# Altium project PhotodiodeDaughterBoard.PrjPcb
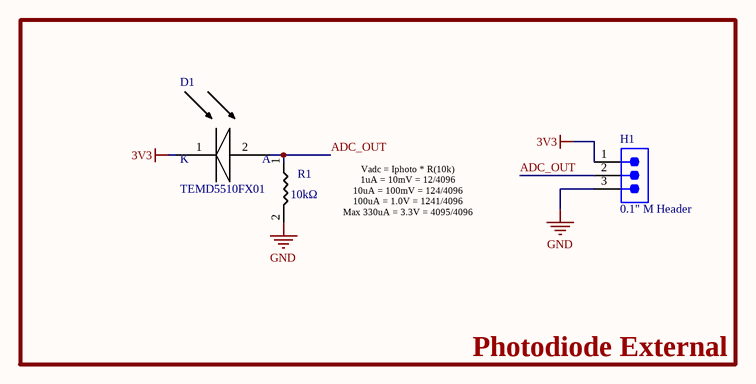
[diagram p0: PhotodiodeDaughterBoard.SchDoc]
1 sheet, 3 parts. Net scope: global (net labels, ports and power ports of the same name join across sheets).
Board file: PhotodiodeDaughterBoard.PcbDoc

## Sheet PhotodiodeDaughterBoard.SchDoc
size Letter; SheetNumber: 1; SheetTotal: 1

### Parts
D1  TEMD5510FX01  [TEMD5510FX01]
H1  0.1" M Header  [3_PIN_100mil_Photodiode]
R1  value 10kΩ  [0603_Resistor]  (hidden comment: 10kkΩ)

### Blocks framed on the sheet
Photodiode External: D1 H1 R1

### Nets
3V3: D1.1(K) H1.1
GND: H1.3 R1.2
ADC_OUT: D1.2(A) H1.2 R1.1

### Notes on the sheet
- (near R1) Vadc = Iphoto * R(10k)
  1uA = 10mV = 12/4096
  10uA = 100mV = 124/4096
  100uA = 1.0V = 1241/4096
  Max 330uA = 3.3V = 4095/4096

### Library data of the parts
D1 = TEMD5510FX01: Ambient Light Sensor Photodiode; Supplier: DigiKey; Digikey Part Number: TEMD5510FX01CT-ND
H1 = Photodiode_3Pin_100mil: CONN HEADER VERT 3POS 2.54MM; Manufacturer: Sullins; Manufacturer Part Number: PRPC003SAAN-RC; Connector Type: Header, Unshrouded, Breakaway; Number of Positions: 3; Number of Positions Loaded: All; Pitch: 0.100" (2.54mm); Online Catalog: 0.100" (2.54mm) Pitch Connector Headers; Other Names: S9510E-03  S9510E-03-ND; Supplier 1: Digi-Key; Stock 1: 19067; Pricing 1: 1=0.12, 10=0.109, 25=0.0812, 50=0.0696, 100=0.0673, 250=0.058, 500=0.0557 (USD); Standard Package: 1; Category: Connectors, Interconnects; Family: Rectangular Connectors - Headers, Male Pins; Series: -; Packaging: Bulk; Contact Type: Male Pin; Number of Rows: 1; Row Spacing: -; Contact Mating Length: 0.230" (5.84mm); Mounting Type: Through Hole; Termination: Solder; Fastening Type: -; Features: -; Contact Finish: Gold; Contact Finish Thickness: Flash; Color: Black; ComponentLink1URL: https://media.digikey.com/PDF/Data%20Sheets/Sullins%20PDFs/xRxCzzzSxxN-RC_ST_11635-B.pdf?src-supplier=Digi-Key; ComponentLink1Description: https://media.digikey.com/PDF/Data%20Sheets/Sullins%20PDFs/xRxCzzzSxxN-RC_ST_11635-B.pdf?src-supplier=Digi-Key; Supplier Part Number 1: S1011EC-03-ND
R1 = R_0603_Photodiode: Fixed Resistor, Metal Glaze/Thick Film, 0.1W, 10000ohm, 75V, 1% +/-Tol, Surface Mount, 0603; Manufacturer: Vishay; Manufacturer Part Number: CRCW060310K0FKEA; Max Power Dissipation: 100mW; Temperature Coefficient: 100ppm/°C; Supplier Part Number: 541-10.0KHDKR-ND; RoHS: Compliant; Category: Chip SMD Resistors; Stock: 4333226; Pricing: 1=0.1, 10=0.032, 25=0.024, 50=0.0194, 100=0.0158, 250=0.0124, 500=0.01046, 1000=0.00893 (USD); Case/Package: 0603; Case Code (Imperial): 0603; China RoHS: Non-Compliant; Composition: Thick Film; Contact Plating: Lead, Tin; Country of Origin: Israel, Taiwan; Depth: 850µm; Export Control Classification Number (ECCN) Code: EAR99; Features: Automotive AEC-Q200; Height: 450µm; Harmonized Tariff Schedule (HTS) Code: 8533.21.00.30; Introduction Date: 2005-02-16; Lead Free: Lead Free; Length: 1.55mm; Lifecycle Status: Production; Max Operating Temperature: 155°C; Military Standard: Not; Min Operating Temperature: -55°C; Mounting Technology: Surface Mount; Pins: 2; Number of Terminals: 2; Number of Terminations: 2; Packaging: Tape and Reel; Power Rating: 100mW; Radiation Hardening: No; Ratings: AEC-Q200; REACH SVHC: Unaffected; Schedule B: 8533210045, 8533210045|8533210045|8533210045|8533210045|8533210045|8533210045|8533210045|8533210045|8533210045|8533210045|8533210045|8533210045|8533210045|8533210045|8533210045|8533210045|8533210045|8533210045|8533210045|8533210045|8533210045|8533210045|8533210045|85; Termination: SMD/SMT; Tolerance: 1%; Voltage Rating: 75V; Voltage Rating (DC): 75V; Weight: 2.012816mg; Width: 850µm; Working Voltage: 75V; ComponentLink1URL: https://datasheet.octopart.com:443/CRCW060310K0FKEA-Vishay-datasheet-175423584.pdf?src-supplier=IHS; ComponentLink1Description: https://datasheet.octopart.com:443/CRCW060310K0FKEA-Vishay-datasheet-175423584.pdf?src-supplier=IHS; ComponentLink2URL: https://datasheet.octopart.com:443/CRCW060310K0FKEA-Vishay-datasheet-5300368.pdf?src-supplier=Future+Electronics; ComponentLink2Description: https://datasheet.octopart.com:443/CRCW060310K0FKEA-Vishay-datasheet-5300368.pdf?src-supplier=Future+Electronics; ComponentLink3URL: https://datasheet.octopart.com:443/CRCW060310K0FKEA-Vishay-datasheet-62316122.pdf?src-supplier=Future+Electronics; ComponentLink3Description: https://datasheet.octopart.com:443/CRCW060310K0FKEA-Vishay-datasheet-62316122.pdf?src-supplier=Future+Electronics; ComponentLink4URL: https://datasheet.octopart.com:443/CRCW060310K0FKEA-Vishay-datasheet-141434677.pdf?src-supplier=Upverter; ComponentLink4Description: https://datasheet.octopart.com:443/CRCW060310K0FKEA-Vishay-datasheet-141434677.pdf?src-supplier=Upverter; ComponentLink5URL: https://datasheet.octopart.com:443/CRCW060310K0FKEA-Vishay-datasheet-83961561.pdf?src-supplier=Newark; ComponentLink5Description: https://datasheet.octopart.com:443/CRCW060310K0FKEA-Vishay-datasheet-83961561.pdf?src-supplier=Newark; ComponentLink6URL: https://datasheet.octopart.com:443/CRCW060310K0FKEA-Vishay-datasheet-14722531.pdf?src-supplier=Newark; ComponentLink6Description: https://datasheet.octopart.com:443/CRCW060310K0FKEA-Vishay-datasheet-14722531.pdf?src-supplier=Newark; ComponentLink7URL: https://datasheet.octopart.com:443/CRCW060310K0FKEA-Vishay-datasheet-11516975.pdf?src-supplier=Newark; ComponentLink7Description: https://datasheet.octopart.com:443/CRCW060310K0FKEA-Vishay-datasheet-11516975.pdf?src-supplier=Newark; ComponentLink8URL: https://datasheet.octopart.com:443/CRCW060310K0FKEA-Vishay-datasheet-41302739.pdf?src-supplier=Newark; ComponentLink8Description: https://datasheet.octopart.com:443/CRCW060310K0FKEA-Vishay-datasheet-41302739.pdf?src-supplier=Newark; ComponentLink9URL: https://datasheet.octopart.com:443/CRCW060310K0FKEA-Vishay-datasheet-33013972.pdf?src-supplier=Newark; ComponentLink9Description: https://datasheet.octopart.com:443/CRCW060310K0FKEA-Vishay-datasheet-33013972.pdf?src-supplier=Newark; ComponentLink10URL: https://datasheet.octopart.com:443/CRCW060310K0FKEA-Vishay-datasheet-21226360.pdf?src-supplier=Newark; ComponentLink10Description: https://datasheet.octopart.com:443/CRCW060310K0FKEA-Vishay-datasheet-21226360.pdf?src-supplier=Newark; ComponentLink11URL: https://datasheet.octopart.com:443/CRCW060310K0FKEA-Vishay-datasheet-62317933.pdf?src-supplier=element14+APAC; ComponentLink11Description: https://datasheet.octopart.com:443/CRCW060310K0FKEA-Vishay-datasheet-62317933.pdf?src-supplier=element14+APAC; ComponentLink12URL: https://datasheet.octopart.com:443/CRCW060310K0FKEA-Vishay-datasheet-16179825.pdf?src-supplier=element14+APAC; ComponentLink12Description: https://datasheet.octopart.com:443/CRCW060310K0FKEA-Vishay-datasheet-16179825.pdf?src-supplier=element14+APAC; ComponentLink13URL: https://datasheet.octopart.com:443/CRCW060310K0FKEA-Vishay-datasheet-66077789.pdf?src-supplier=element14+APAC; ComponentLink13Description: https://datasheet.octopart.com:443/CRCW060310K0FKEA-Vishay-datasheet-66077789.pdf?src-supplier=element14+APAC; ComponentLink14URL: https://datasheet.octopart.com:443/CRCW060310K0FKEA-Vishay-datasheet-5306405.pdf?src-supplier=RS+(Formerly+Allied+Electronics); ComponentLink14Description: https://datasheet.octopart.com:443/CRCW060310K0FKEA-Vishay-datasheet-5306405.pdf?src-supplier=RS+(Formerly+Allied+Electronics); ComponentLink15URL: https://datasheet.octopart.com:443/CRCW060310K0FKEA-Vishay-Dale-datasheet-47688880.pdf?src-supplier=RS+(Formerly+Allied+Electronics); ComponentLink15Description: https://datasheet.octopart.com:443/CRCW060310K0FKEA-Vishay-Dale-datasheet-47688880.pdf?src-supplier=RS+(Formerly+Allied+Electronics); ComponentLink16URL: https://datasheet.octopart.com:443/CRCW060310K0FKEA-Vishay-datasheet-12001583.pdf?src-supplier=RS+(Formerly+Allied+Electronics); ComponentLink16Description: https://datasheet.octopart.com:443/CRCW060310K0FKEA-Vishay-datasheet-12001583.pdf?src-supplier=RS+(Formerly+Allied+Electronics); ComponentLink17URL: https://datasheet.octopart.com:443/CRCW060310K0FKEA-Vishay-datasheet-17834126.pdf?src-supplier=TME; ComponentLink17Description: https://datasheet.octopart.com:443/CRCW060310K0FKEA-Vishay-datasheet-17834126.pdf?src-supplier=TME; ComponentLink18URL: https://datasheet.octopart.com:443/CRCW060310K0FKEA-Vishay-datasheet-13242068.pdf?src-supplier=Farnell; ComponentLink18Description: https://datasheet.octopart.com:443/CRCW060310K0FKEA-Vishay-datasheet-13242068.pdf?src-supplier=Farnell; ComponentLink19URL: https://datasheet.octopart.com:443/CRCW060310K0FKEA-Vishay-datasheet-13195083.pdf?src-supplier=Farnell; ComponentLink19Description: https://datasheet.octopart.com:443/CRCW060310K0FKEA-Vishay-datasheet-13195083.pdf?src-supplier=Farnell; ComponentLink20URL: https://datasheet.octopart.com:443/CRCW060310K0FKEA-Vishay-datasheet-13034211.pdf?src-supplier=Farnell; ComponentLink20Description: https://datasheet.octopart.com:443/CRCW060310K0FKEA-Vishay-datasheet-13034211.pdf?src-supplier=Farnell; ComponentLink21URL: https://datasheet.octopart.com:443/CRCW060310K0FKEA-Vishay-datasheet-12600034.pdf?src-supplier=Farnell; ComponentLink21Description: https://datasheet.octopart.com:443/CRCW060310K0FKEA-Vishay-datasheet-12600034.pdf?src-supplier=Farnell; ComponentLink22URL: https://datasheet.octopart.com:443/CRCW060310K0FKEA-Vishay-datasheet-12532161.pdf?src-supplier=Farnell; ComponentLink22Description: https://datasheet.octopart.com:443/CRCW060310K0FKEA-Vishay-datasheet-12532161.pdf?src-supplier=Farnell; ComponentLink23URL: https://datasheet.octopart.com:443/CRCW060310K0FKEA-Vishay-datasheet-12517896.pdf?src-supplier=Farnell; ComponentLink23Description: https://datasheet.octopart.com:443/CRCW060310K0FKEA-Vishay-datasheet-12517896.pdf?src-supplier=Farnell; ComponentLink24URL: https://datasheet.octopart.com:443/CRCW060310K0FKEA-Vishay-datasheet-12509762.pdf?src-supplier=Farnell; ComponentLink24Description: https://datasheet.octopart.com:443/CRCW060310K0FKEA-Vishay-datasheet-12509762.pdf?src-supplier=Farnell; ComponentLink25URL: https://datasheet.octopart.com:443/CRCW060310K0FKEA-Vishay-datasheet-10322335.pdf?src-supplier=Farnell; ComponentLink25Description: https://datasheet.octopart.com:443/CRCW060310K0FKEA-Vishay-datasheet-10322335.pdf?src-supplier=Farnell; ComponentLink26URL: https://datasheet.octopart.com:443/CRCW060310K0FKEA-Vishay-datasheet-8788789.pdf?src-supplier=Farnell; ComponentLink26Description: https://datasheet.octopart.com:443/CRCW060310K0FKEA-Vishay-datasheet-8788789.pdf?src-supplier=Farnell; ComponentLink27URL: https://datasheet.octopart.com:443/CRCW060310K0FKEA-Vishay-datasheet-8361388.pdf?src-supplier=Farnell; ComponentLink27Description: https://datasheet.octopart.com:443/CRCW060310K0FKEA-Vishay-datasheet-8361388.pdf?src-supplier=Farnell; ComponentLink28URL: https://datasheet.octopart.com:443/CRCW060310K0FKEA-Vishay-datasheet-546287.pdf?src-supplier=Farnell; ComponentLink28Description: https://datasheet.octopart.com:443/CRCW060310K0FKEA-Vishay-datasheet-546287.pdf?src-supplier=Farnell; ComponentLink29URL: https://datasheet.octopart.com:443/CRCW060310K0FKEA-Vishay-datasheet-8619608.pdf?src-supplier=element14; ComponentLink29Description: https://datasheet.octopart.com:443/CRCW060310K0FKEA-Vishay-datasheet-8619608.pdf?src-supplier=element14; ComponentLink30URL: https://datasheet.octopart.com:443/CRCW060310K0FKEA-Vishay-datasheet-5377433.pdf?src-supplier=Garrett; ComponentLink30Description: https://datasheet.octopart.com:443/CRCW060310K0FKEA-Vishay-datasheet-5377433.pdf?src-supplier=Garrett; ComponentLink31URL: https://datasheet.octopart.com:443/CRCW060310K0FKEA-Vishay-datasheet-148188.pdf?src-supplier=Garrett; ComponentLink31Description: https://datasheet.octopart.com:443/CRCW060310K0FKEA-Vishay-datasheet-148188.pdf?src-supplier=Garrett; ComponentLink32URL: https://datasheet.octopart.com:443/CRCW060310K0FKEA-Vishay-datasheet-30224.pdf?src-supplier=Garrett; ComponentLink32Description: https://datasheet.octopart.com:443/CRCW060310K0FKEA-Vishay-datasheet-30224.pdf?src-supplier=Garrett; ComponentLink33URL: https://datasheet.octopart.com:443/CRCW060310K0FKEA-Vishay-datasheet-11835177.pdf?src-supplier=Arrow+Electronics; ComponentLink33Description: https://datasheet.octopart.com:443/CRCW060310K0FKEA-Vishay-datasheet-11835177.pdf?src-supplier=Arrow+Electronics; ComponentLink34URL: http://sigma.octopart.com:80/rohs_statement/Vishay-company-15.pdf?src-supplier=Compliance+Statements; ComponentLink34Description: http://sigma.octopart.com:80/rohs_statement/Vishay-company-15.pdf?src-supplier=Compliance+Statements; Digikey Part Number: 541-10.0KHCT-ND; Supplier: DigiKey